# Altium schematic sheet Sheet2.SchDoc
size A4
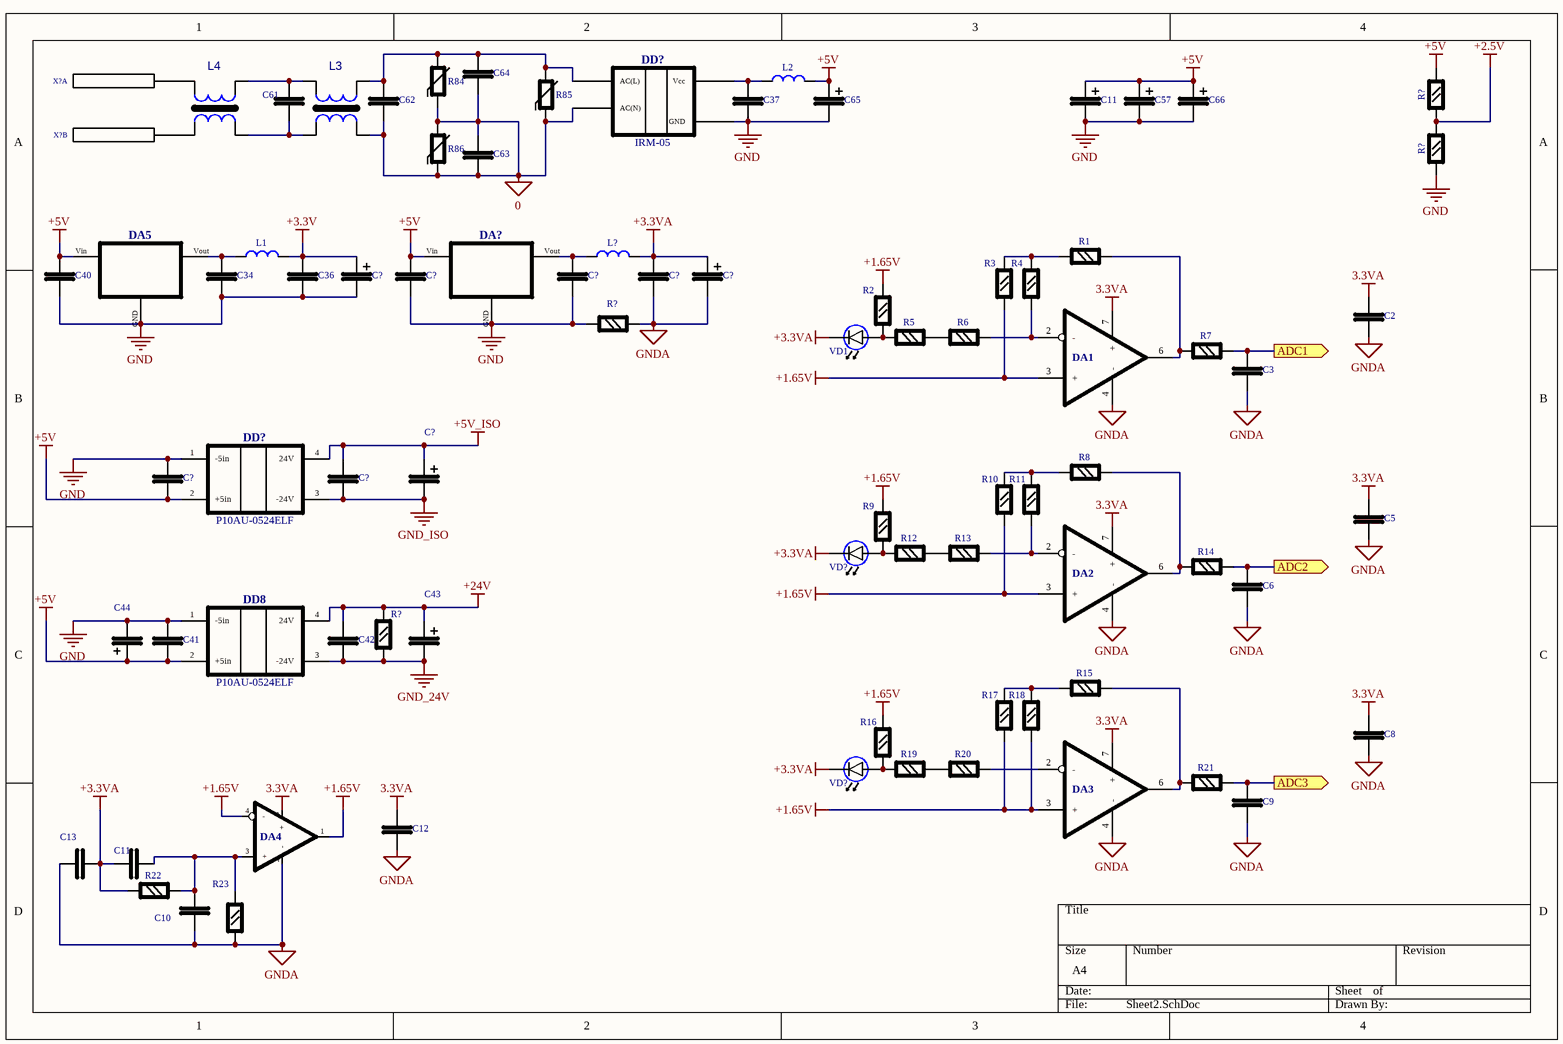
[diagram p0: Sheet2.SchDoc]

## Parts
(Parts that share a designator on the sheet are numbered #1, #2 ... from top to bottom, then left to right.)
C2  CAP_0805  [CAP_0805]  (value not drawn)
C3  CAP_0805  [CAP_0805]  (value not drawn)
C5  CAP_0805  [CAP_0805]  (value not drawn)
C6  CAP_0805  [CAP_0805]  (value not drawn)
C8  CAP_0805  [CAP_0805]  (value not drawn)
C9  CAP_0805  [CAP_0805]  (value not drawn)
C10  CAP_0805  [CAP_0805]  (value not drawn)
C11#1  CAP470_6V  [CAP470_6V]  (value not drawn)
C11#2  CAP_0805  [CAP_0805]  (value not drawn)
C12  CAP_0805  [CAP_0805]  (value not drawn)
C13  CAP_0805  [CAP_0805]  (value not drawn)
C34  CAP_0805  [CAP_0805]  (value not drawn)
C36  CAP_0805  [CAP_0805]  (value not drawn)
C37  CAP_0805  [CAP_0805]  (value not drawn)
C40  CAP_0805  [CAP_0805]  (value not drawn)
C41  CAP_0805  [CAP_0805]  (value not drawn)
C42  CAP_0805  [CAP_0805]  (value not drawn)
C43  CAP100_16  [CAP10]  (value not drawn)
C44  CAP10_35V  [CAP10_35V_CAP10_35V(Primary)]  (value not drawn)
C57  CAP470_6V  [CAP470_6V]  (value not drawn)
C61  CAP_0805  [CAP_0805]  (value not drawn)
C62  CAP_0805  [CAP_0805]  (value not drawn)
C63  CAP_0805  [CAP_0805]  (value not drawn)
C64  CAP_0805  [CAP_0805]  (value not drawn)
C65  CAP470_6V  [CAP470_6V]  (value not drawn)
C66  CAP470_6V  [CAP470_6V]  (value not drawn)
C?#1  CAP470_6V  [CAP470_6V]  (value not drawn)
C?#2  CAP_0805  [CAP_0805]  (value not drawn)
C?#3  CAP_0805  [CAP_0805]  (value not drawn)
C?#4  CAP_0805  [CAP_0805]  (value not drawn)
C?#5  CAP470_6V  [CAP470_6V]  (value not drawn)
C?#6  CAP_0805  [CAP_0805]  (value not drawn)
C?#7  CAP_0805  [CAP_0805]  (value not drawn)
C?#8  CAP100_16  [CAP10]  (value not drawn)
DA1  AD8628AR  [SO8]  (value not drawn)
DA2  AD8628AR  [SO8]  (value not drawn)
DA3  AD8628AR  [SO8]  (value not drawn)
DA4  AD8628ART_1  [SOT_23_5PIN]  (value not drawn)
DA5  LM1117_DT  [DPAK_CASE369A_13_LM1117_DT(Primary)]  (value not drawn)
DA?  LM1117_DT  [DPAK_CASE369A_13_LM1117_DT(Primary)]  (value not drawn)
DD8  P10AU-0524ELF  [P10AU-0524]
DD?#1  IRM-05  [IRM-05_IRM-05(Primary)]
DD?#2  P10AU-0524ELF  [P10AU-0524]
L1  EXCELDR35C  [EXCELDR35C]  (value not drawn)
L2  EXCELDR35C  [EXCELDR35C]  (value not drawn)
L3  DROS_FILTR  [DROS_FILTR]  (value not drawn)
L4  DROS_FILTR  [DROS_FILTR]  (value not drawn)
L?  EXCELDR35C  [EXCELDR35C]  (value not drawn)
R1  RES_0805  [RES_0805]  (value not drawn)
R2  RES_0805  [RES_0805]  (value not drawn)
R3  RES_0805  [RES_0805]  (value not drawn)
R4  RES_0805  [RES_0805]  (value not drawn)
R5  RES_0805  [RES_0805]  (value not drawn)
R6  RES_0805  [RES_0805]  (value not drawn)
R7  RES_0805  [RES_0805]  (value not drawn)
R8  RES_0805  [RES_0805]  (value not drawn)
R9  RES_0805  [RES_0805]  (value not drawn)
R10  RES_0805  [RES_0805]  (value not drawn)
R11  RES_0805  [RES_0805]  (value not drawn)
R12  RES_0805  [RES_0805]  (value not drawn)
R13  RES_0805  [RES_0805]  (value not drawn)
R14  RES_0805  [RES_0805]  (value not drawn)
R15  RES_0805  [RES_0805]  (value not drawn)
R16  RES_0805  [RES_0805]  (value not drawn)
R17  RES_0805  [RES_0805]  (value not drawn)
R18  RES_0805  [RES_0805]  (value not drawn)
R19  RES_0805  [RES_0805]  (value not drawn)
R20  RES_0805  [RES_0805]  (value not drawn)
R21  RES_0805  [RES_0805]  (value not drawn)
R22  RES_0805  [RES_0805]  (value not drawn)
R23  RES_0805  [RES_0805]  (value not drawn)
R84  VAR1  [VAR]  (value not drawn)
R85  VARISTOR  [VARISTOR]  (value not drawn)
R86  VAR1  [VAR]  (value not drawn)
R?#1  RES_0805  [RES_0805]  (value not drawn)
R?#2  RES_0805  [RES_0805]  (value not drawn)
R?#3  RES_0805  [RES_0805]  (value not drawn)
R?#4  RES_0805  [RES_0805]  (value not drawn)
VD1  LED_3MM  [VD_3MM]  (value not drawn)
VD?#1  LED_3MM  [VD_3MM]  (value not drawn)
VD?#2  LED_3MM  [VD_3MM]  (value not drawn)
X?#1  DFK-MSTBA2.5/2-GF-5.08  [DFK_MSTBA2_ALL]  (value not drawn)  (part A of 2)
X?#2  DFK-MSTBA2.5/2-GF-5.08  [DFK_MSTBA2_ALL]  (value not drawn)  (part B of 2)

## Ports
ADC1 (out), ADC2 (out), ADC3 (out)

## Nets
0: C62.1(D1) C63.1(D1) C63.2(D2) C64.1(D1) DD?#1.NEUTRAL(AC(N)) L3.4 R84.1(D1) R85.1(D1) R86.1(D1) R86.2(D2)
3.3VA: C2.2(D2) C5.2(D2) C8.2(D2) C12.2(D2) DA1.7(+) DA2.7(+) DA3.7(+) DA4.5(+)
+1.65V: DA1.3(+) DA2.3(+) DA3.3(+) DA4.1(OUT) DA4.4(-) R2.2(D2) R3.1(D1) R9.2(D2) R10.1(D1) R16.2(D2) R17.1(D1) R18.1(D1)
+2.5V: R?#1.1(D1) R?#2.2(D2)
+3.3V: C36.2(D2) C?#1.1(D1) L1.2(D2)
+3.3VA: C11#2.2(D2) C13.1(D1) C?#4.2(D2) C?#5.1(D1) L?.2(D2) R22.1(D1) VD1.1(C) VD?#1.1(C) VD?#2.1(C)
+5V: C11#1.1(D1) C40.2(D2) C41.1(D1) C44.plus(D1) C57.1(D1) C65.1(D1) C66.1(D1) C?#2.2(D2) C?#6.1(D1) DA5.Vin DA?.Vin DD8.2(+5in) DD?#2.2(+5in) L2.2(D2) R?#1.2(D2)
+5V_ISO: C?#7.2(D2) C?#8.1(D1) DD?#2.4(24V)
+24V: C42.2(D2) C43.1(D1) DD8.4(24V) R?#4.2(D2)
GND: C11#1.2(D2) C34.1(D1) C36.1(D1) C37.1(D1) C40.1(D1) C41.2(D2) C44.Minus(D2) C57.2(D2) C65.2(D2) C66.2(D2) C?#1.2(D2) C?#2.1(D1) C?#3.1(D1) C?#6.2(D2) DA5.GND DA?.GND DD8.1(-5in) DD?#1.GND DD?#2.1(-5in) R?#2.1(D1) R?#3.2(D2)
GND_24V: C42.1(D1) C43.2(D2) DD8.3(-24V) R?#4.1(D1)
GND_ISO: C?#7.1(D1) C?#8.2(D2) DD?#2.3(-24V)
GNDA: C2.1(D1) C3.1(D1) C5.1(D1) C6.1(D1) C8.1(D1) C9.1(D1) C10.1(D1) C12.1(D1) C13.2(D2) C?#4.1(D1) C?#5.2(D2) DA1.4(-) DA2.4(-) DA3.4(-) DA4.2(-) R23.1(D1) R?#3.1(D1)
ADC1: C3.2(D2) R7.2(D2) ; port ADC1
ADC2: C6.2(D2) R14.2(D2) ; port ADC2
ADC3: C9.2(D2) R21.2(D2) ; port ADC3
NetC10_2: C10.2(D2) C11#2.1(D1) DA4.3(+) R22.2(D2) R23.2(D2)
NetC34_2: C34.2(D2) DA5.Vout L1.1(D1)
NetC37_2: C37.2(D2) DD?#1.Vcc L2.1(D1)
NetC61_1: C61.1(D1) L3.2 L4.4
NetC61_2: C61.2(D2) L3.1 L4.3
NetC62_2: C62.2(D2) C64.2(D2) DD?#1.LINE(AC(L)) L3.3 R84.2(D2) R85.2(D2)
NetC?#3_2: C?#3.2(D2) DA?.Vout L?.1(D1)
NetDA1_2: DA1.2(-) R4.1(D1) R6.2(D2)
NetDA1_6: DA1.6(OUT) R1.2(D2) R7.1(D1)
NetDA2_2: DA2.2(-) R11.1(D1) R13.2(D2)
NetDA2_6: DA2.6(OUT) R8.2(D2) R14.1(D1)
NetDA3_2: DA3.2(-) R20.2(D2)
NetDA3_6: DA3.6(OUT) R15.2(D2) R21.1(D1)
NetL4_1: L4.1 X?#1.1
NetL4_2: L4.2 X?#2.2
NetR1_1: R1.1(D1) R3.2(D2) R4.2(D2)
NetR2_1: R2.1(D1) R5.1(D1) VD1.2(A)
NetR5_2: R5.2(D2) R6.1(D1)
NetR8_1: R8.1(D1) R10.2(D2) R11.2(D2)
NetR9_1: R9.1(D1) R12.1(D1) VD?#1.2(A)
NetR12_2: R12.2(D2) R13.1(D1)
NetR15_1: R15.1(D1) R17.2(D2) R18.2(D2)
NetR16_1: R16.1(D1) R19.1(D1) VD?#2.2(A)
NetR19_2: R19.2(D2) R20.1(D1)

Not connected (* = marked no-connect by the designer): DA1 1 5 8; DA2 1 5 8; DA3 1 5 8; X?#1 3 4; X?#2 3 4

## Library data of the parts
C2 C3 C5 C6 C8-C10 C11#2 C12 C13 C34 C36 C37 C40-C42 C61-C64 C?#2-C?#4 C?#6 C?#7 = CAP_0805: Value: *
C11#1 C57 C65 C66 C?#1 C?#5 = CAP470_6V: Value: *
C43 C?#8 = CAP100_16: Value: *
C44 = CAP10_35V: Value: *
DA1-DA3 = AD8628AR: Value: *
DA4 = AD8628ART_1: Value: *
DA5 DA? = LM1117_DT: Value: *
DD8 DD?#2 = P10AU-0524ELF: Value: *
DD?#1 = IRM-05: Value: *
L1 L2 L? = EXCELDR35C: Value: *
L3 L4 = DROS_FILTR: Value: *
R1-R23 R?#1-R?#4 = RES_0805: Value: *
R84 R86 = VAR1: Value: *
R85 = VARISTOR: Value: *
VD1 VD?#1 VD?#2 = LED_3MM: Value: *
X?#1 X?#2 = DFK-MSTBA2.5/2-GF-5.08: Value: *